# EAGLE design SI4735 Shield-v12 (EAGLE 5.06)
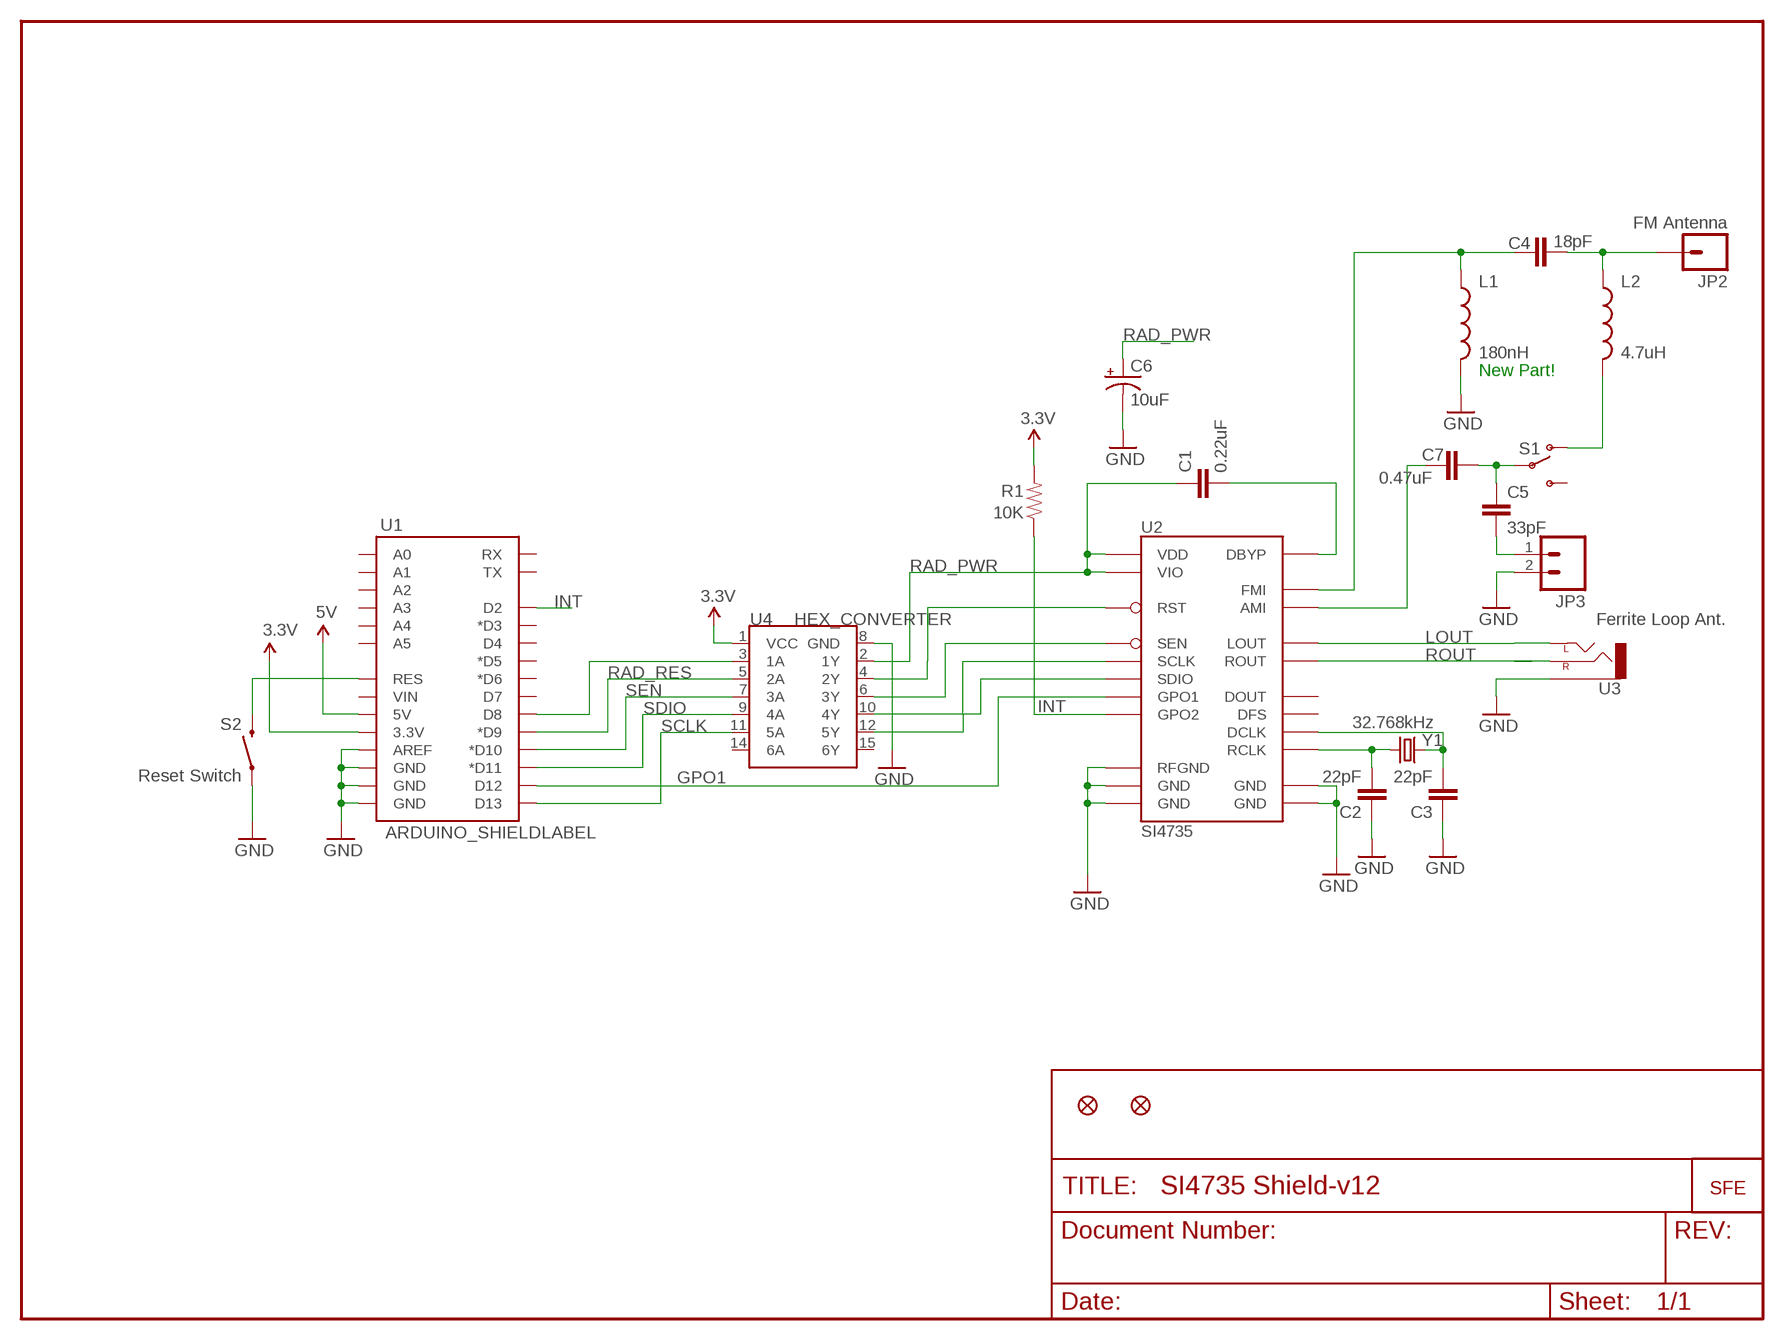
[diagram p0: schematic, sheet 1]

## Parts
C1  0.22uF  CAP0402-CAP  [0402-CAP]
C2  22pF  CAP0402-CAP  [0402-CAP]
C3  22pF  CAP0402-CAP  [0402-CAP]
C4  18pF  CAP0402-CAP  [0402-CAP]
C5  33pF  CAP0402-CAP  [0402-CAP]
C6  10uF  CAP_POL3528  [EIA3528]
C7  0.47uF  CAP0402-CAP  [0402-CAP]
JP1  LOGO-SFENEW  [SFE-NEW-WEBLOGO]
JP2  FM Antenna  M01PTH  [1X01]
JP3  Ferrite Loop Ant.  M02PTH  [1X02]
JP4  FIDUCIAL1X2  [FIDUCIAL-1X2]
JP5  FIDUCIAL1X2  [FIDUCIAL-1X2]
L1  180nH  INDUCTOR0402  [C0402]
L2  4.7uH  INDUCTOR0402  [C0402]
R1  10K  RESISTOR0402-RES  [0402-RES]
S1  SWITCH-SPSTSMD  [AYZ0202]
S2  Reset Switch  SWITCH-MOMENTARY-2SMD  [TACTILE_SWITCH_SMD]
U1  ARDUINO_SHIELDLABEL  [DUEMILANOVE_SHIELD]
U2  SI4735  [SSOP24_NARROW]
U3  AUDIO-JACKSMD2  [AUDIO-JACK-3.5MM-SMD]
U4  HEX_CONVERTER  [SO016]
Y1  32.768kHz  CRYSTAL32-SMD  [CRYSTAL-32KHZ-SMD]

## Nets
3.3V: R1.2 U1.3.3V U4.1(VCC)
5V: U1.5V
GND: C2.1 C3.1 C6.C(-) JP3.2 L1.2 S2.1 U1.AREF U1.GND@0(GND) U1.GND@1(GND) U1.GND@2(GND) U2.9(RFGND) U2.10(GND) U2.11(GND) U2.13(GND) U2.14(GND) U3.SLEEVE U4.8(GND)
GPO1: U1.D12 U2.5(GPO1)
INT: R1.1 U1.D2 U2.4(GPO2)
LOUT: U2.24(LOUT) U3.TIP(LEFT)
N$1: C2.2 U2.19(RCLK) Y1.X1
N$2: C3.2 U2.3(DCLK) Y1.X2
N$3: S2.3 U1.RES
N$4: C1.2 U2.22(DBYP)
N$5: U2.15(RST) U4.4(2Y)
N$12: U2.16(SEN) U4.6(3Y)
N$15: U2.17(SCLK) U4.12(5Y)
N$16: U2.18(SDIO) U4.10(4Y)
N$17: C4.1 L1.1 U2.8(FMI)
N$20: U1.D8 U4.3(1A)
N$21: C4.2 JP2.1 L2.1
N$22: L2.2 S1.1(O)
N$23: C5.1 C7.1 S1.2(P)
N$34: C7.2 U2.12(AMI)
N$35: C5.2 JP3.1
RAD_PWR: C1.1 C6.A(+) U2.20(VIO) U2.21(VDD) U4.2(1Y)
RAD_RES: U1.D9(*D9) U4.5(2A)
ROUT: U2.23(ROUT) U3.RING(RIGHT)
SCLK: U1.D13 U4.11(5A)
SDIO: U1.D11(*D11) U4.9(4A)
SEN: U1.D10(*D10) U4.7(3A)
Unconnected: S1.3(S) U1.A0 U1.A1 U1.A2 U1.A3 U1.A4 U1.A5 U1.D3(*D3) U1.D4 U1.D5(*D5) U1.D6(*D6) U1.D7 U1.RX U1.TX U1.VIN U2.1(DOUT) U2.2(DFS) U4.14(6A) U4.15(6Y)

## Notes on the sheet
- New Part!

## Library data of the parts
C1-C5 C7 = SparkFun:CAP: Capacitor Standard 0603 ceramic capacitor, and 0.1" leaded capacitor.
C6 = SparkFun:CAP_POL: Capacitor Polarized These are standard SMD and PTH capacitors. Normally 10uF, 47uF, and 100uF in electrolytic and tantalum varieties. Always verify the external diameter of the through hole cap, it varies with capacity, voltage, and manufacturer. The EIA devices should be standard.
JP1 = SparkFun:LOGO-SFE: Spark Fun Electronics PCB Logo This is the standard Spark Fun Electronics PCB logo.
JP2 = SparkFun:M01: Header 1 Standard 1-pin 0.1" header. Use with straight break away headers (SKU : PRT-00116), right angle break away headers (PRT-00553), swiss pins (PRT-00743), machine pins (PRT-00117), and female headers (PRT-00115).
JP3 = SparkFun:M02: Header 2 Standard 2-pin 0.1" header. Use with straight break away headers (SKU : PRT-00116), right angle break away headers (PRT-00553), swiss pins (PRT-00743), machine pins (PRT-00117), and female headers (PRT-00115). Molex polarized connector foot print use with SKU : PRT-08233 with associated crimp pins and housings.
JP4 JP5 = SparkFun:FIDUCIAL: Fiducial Alignment Points Various fiducial points for machine vision alignment.
L1 L2 = SparkFun:INDUCTOR: Inductors Basic Inductor/Choke - 0603 and 1206. Footprints are not proven and vary greatly between part numbers.
R1 = SparkFun:RESISTOR: Resistor Basic schematic elements and footprints for 0603, 1206, and PTH resistors.
S1 = SparkFun:SWITCH-SPST: SPST Switch Simple slide switch. Spark Fun Electronics SKU : COM-00102
S2 = SparkFun:SWITCH-MOMENTARY-2
U1 = SparkFun:ARDUINO_SHIELD
U2 = SparkFun:SI4735: Radio chip that covers FM broadcast with RDS, plus a bunch of shortwave and logwave frequencies
U3 = SparkFun:AUDIO-JACK: 3.5mm Audio Jack Simple 3.5mm common PCB mount audio jack. SKU: PRT-08032
U4 = SparkFun:HEX_CONVERTER
Y1 = SparkFun:CRYSTAL: Crystals Various standard crystals. Proven footprints. Spark Fun Electronics SKU : COM-00534

## Board
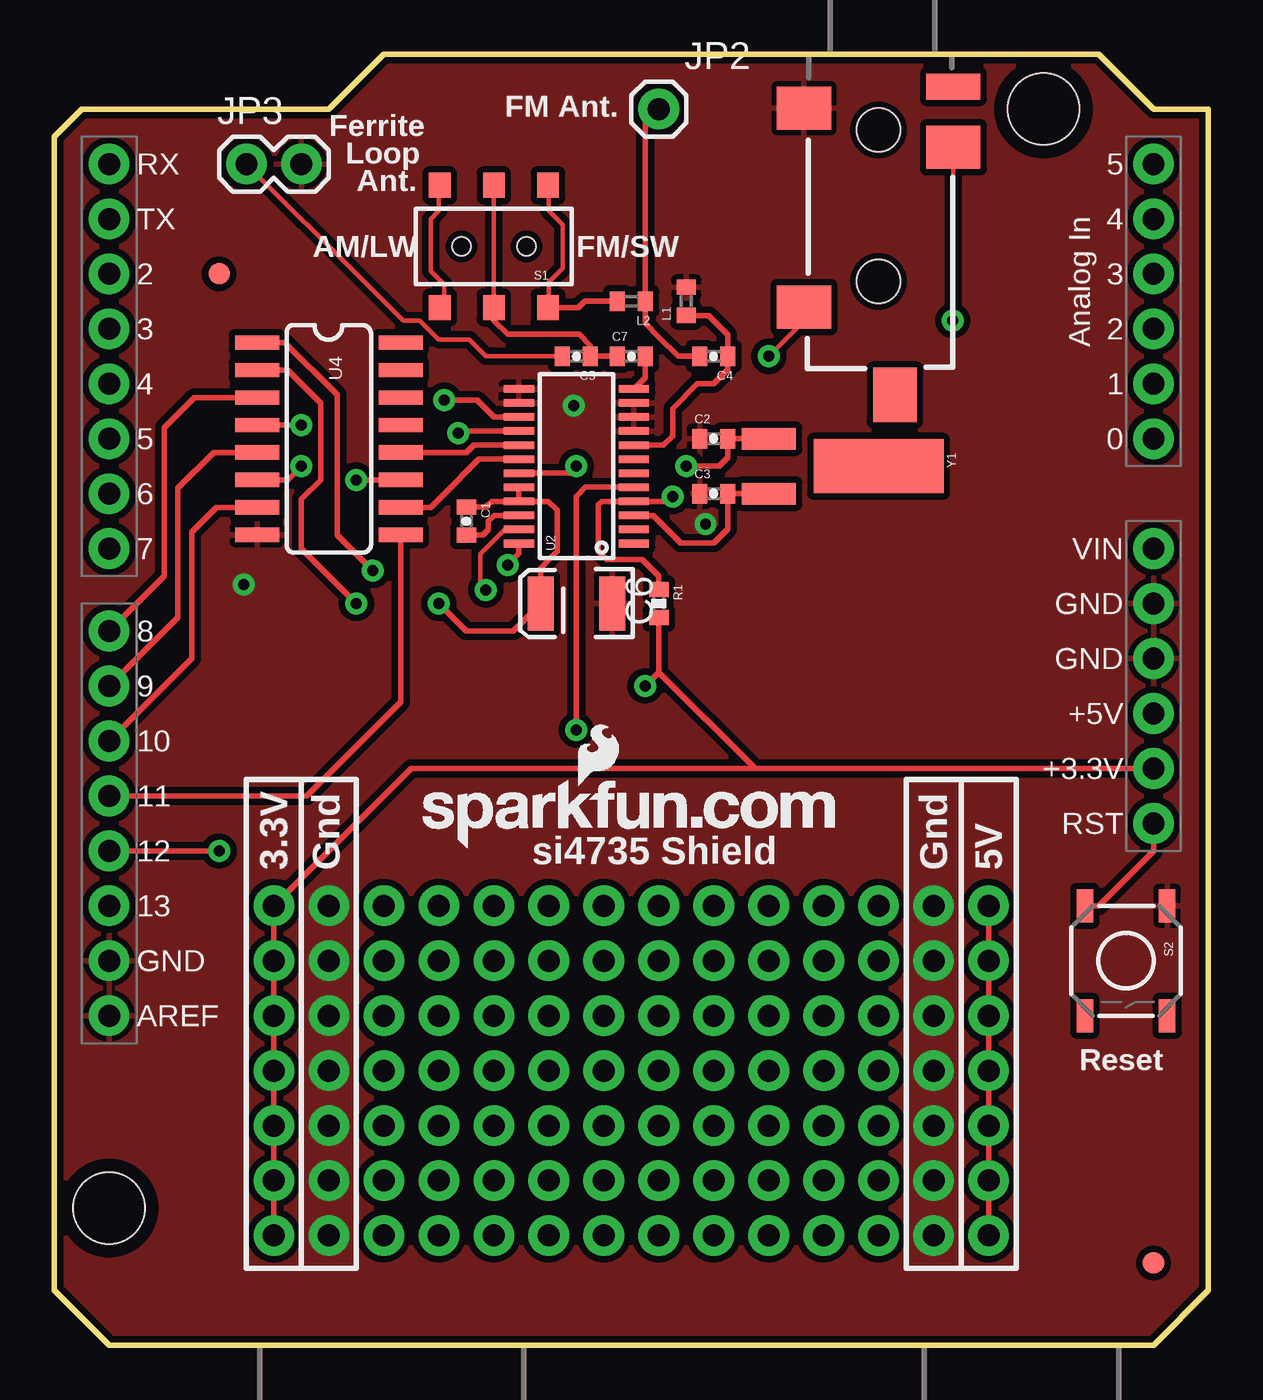
[diagram p1: board, top side]
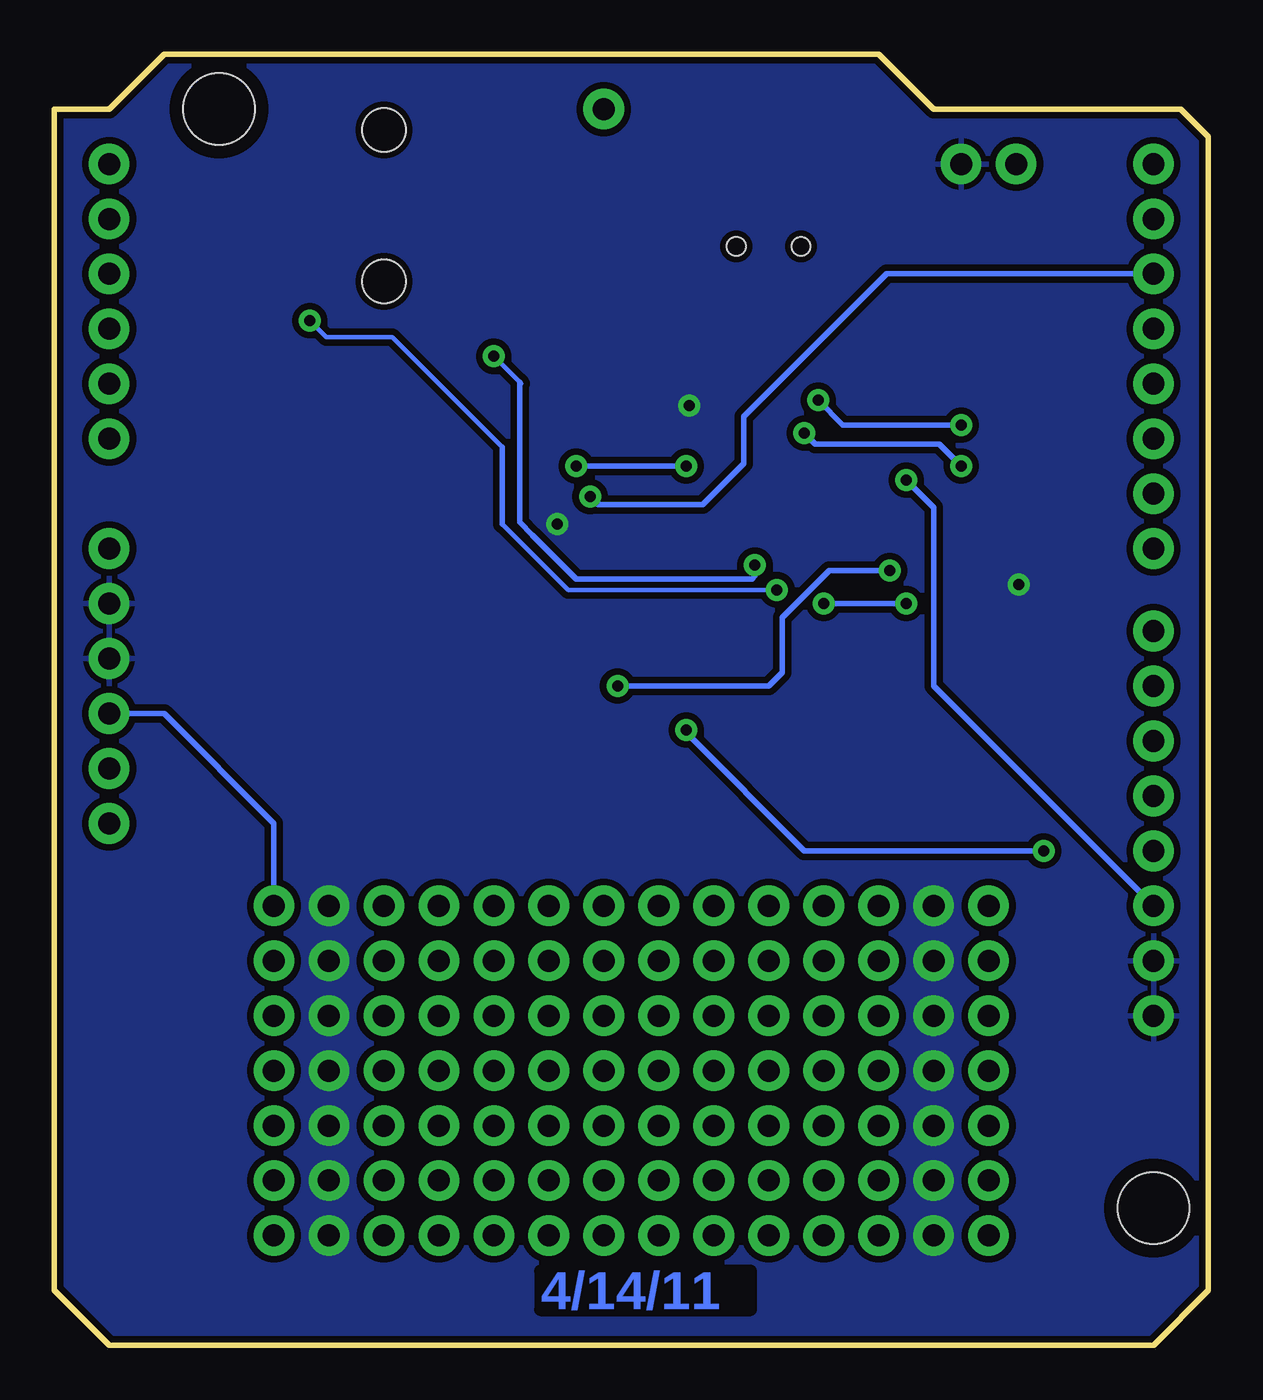
[diagram p2: board, bottom side, seen from below]

Size 53.34 x 59.69 mm. Coordinates in mm from the lower left corner, seen from the top.
Outline: 0,2.54 0,55.88 1.27,57.15 12.7,57.15 15.24,59.69 48.26,59.69 50.8,57.15 53.34,57.15 53.34,2.54 50.8,0 2.54,0 0,2.54
Copper layers (1*16): Top 0.035mm / dielectric 1.5mm / Bottom 0.035mm
Design rules "SparkFun": minimum track width 8mil, minimum drill 20mil, track to track 8mil, track to pad 8mil, pad to pad 8mil, via to via 8mil, smd to smd 8mil, copper to edge 8mil, drill to drill 8mil, minimum pad ring 12mil, minimum via ring 10mil, stop-mask expansion 4mil, vias tented up to drill 20mil, thermal gap 10mil

### Footprints (pad centres in the part's own frame; a part is rotated, then mirrored left to right if it is on the bottom)
0402-CAP = smd 0.7 x 0.9: 1 -0.65,0; 2 0.65,0
EIA3528 = smd 1.2 x 2.5: A 1.65,0; C -1.65,0
1X01 = drill 1.016 pad 1.88 round: 1 0,0
1X02 = drill 1.016 pad 1.88 round: 1 0,0; 2 2.54,0
FIDUCIAL-1X2 = smd 1 x 1: 1 0,0
C0402 = smd 0.7 x 0.9: 1 -0.65,0; 2 0.65,0
0402-RES = smd 0.7 x 0.9: 1 -0.65,0; 2 0.65,0
AYZ0202 = smd 1 x 1.15: 1 -2.5,2.825; 2 0,2.825; 3 2.5,2.825; 4 -2.5,-2.825; 5 0,-2.825; 6 2.5,-2.825 | hole 0.85: 1.5,0; -1.5,0
TACTILE_SWITCH_SMD = smd 1.524 x 0.762: 1 -2.54,1.905; 2 2.54,1.905; 3 -2.54,-1.905; 4 2.54,-1.905
DUEMILANOVE_SHIELD = drill 1.016 pad 1.88 round: 3.3V 50.8,26.67; 5V 50.8,29.21; A0 50.8,41.91; A1 50.8,44.45; A2 50.8,46.99; A3 50.8,49.53; A4 50.8,52.07; A5 50.8,54.61; AREF 2.54,15.24; D2 2.54,49.53; D3 2.54,46.99; D4 2.54,44.45; D5 2.54,41.91; D6 2.54,39.37; D7 2.54,36.83; D8 2.54,33.02; D9 2.54,30.48; D10 2.54,27.94; D11 2.54,25.4; D12 2.54,22.86; D13 2.54,20.32; GND@0 50.8,31.75; GND@1 50.8,34.29; GND@2 2.54,17.78; RES 50.8,24.13; RX 2.54,54.61; TX 2.54,52.07; VIN 50.8,36.83 | hole 3.302: 45.72,57.15; 2.54,6.35
SSOP24_NARROW = smd 0.348 x 1.397: 1 -3.575,-2.65; 2 -2.925,-2.65; 3 -2.275,-2.65; 4 -1.625,-2.65; 5 -0.975,-2.65; 6 -0.325,-2.65; 7 0.325,-2.65; 8 0.975,-2.65; 9 1.625,-2.65; 10 2.275,-2.65; 11 2.925,-2.65; 12 3.575,-2.65; 13 3.575,2.65; 14 2.925,2.65; 15 2.275,2.65; 16 1.625,2.65; 17 0.975,2.65; 18 0.325,2.65; 19 -0.325,2.65; 20 -0.975,2.65; 21 -1.625,2.65; 22 -2.275,2.65; 23 -2.925,2.65; 24 -3.575,2.65
AUDIO-JACK-3.5MM-SMD = smd 2 x 2.5: RING 4.3,3.45; SLEEVE 2.5,-3.45; TIP 11.7,-3.45 | smd 1.2 x 2.5: RSH 1.5,3.45 | smd 2.5 x 2: TSH 15.75,0.75 | hole 2: 3.5,0; 10.5,0
SO016 = smd 0.66 x 2.032: 1 -4.445,-3.315; 2 -3.175,-3.315; 3 -1.905,-3.315; 4 -0.635,-3.315; 5 0.635,-3.315; 6 1.905,-3.315; 7 3.175,-3.315; 8 4.445,-3.315; 9 4.445,3.315; 10 3.175,3.315; 11 1.905,3.315; 12 0.635,3.315; 13 -0.635,3.315; 14 -1.905,3.315; 15 -3.175,3.315; 16 -4.445,3.315
CRYSTAL-32KHZ-SMD = smd 2.5 x 6: SHEILD 0,5.08 | smd 1 x 2.5: X1 -1.27,0; X2 1.27,0

### Placement (x,y rotation side)
C1  19.05,38.1 270 top
C2  30.48,41.91 0 top
C3  30.48,39.37 0 top
C4  30.48,45.72 180 top
C5  24.13,45.72 180 top
C6  24.13,34.29 180 top
C7  26.67,45.72 0 top
JP1  17.02,22.99 0 top
JP2  27.94,57.15 0 top
JP3  8.89,54.61 0 top
JP4  50.8,3.81 0 top
JP5  7.62,49.53 0 top
L1  29.21,48.26 90 top
L2  26.67,48.26 180 top
R1  27.94,34.29 270 top
S1  20.32,50.8 180 top
S2  49.53,17.78 270 top
U1  0,0 0 top
U2  24.13,40.64 90 top
U3  38.1,59.69 270 top
U4  12.7,41.91 270 top
Y1  33.02,40.64 270 top

### Tracks (layer width: path | path; a pad name or v marks a point on that pad's centre or on a via)
3.3V  (via drill 0.51, 1.02 pad 1.88)
  Top 0.254: U4.1 10.67,46.35 13.08,43.94 13.08,39.88 13.08,37.47 v14.73,35.81 | 27.94,31.11 v27.3,30.48 | 27.94,31.11 R1.2 | U1.3.3V 32.38,26.67 32.32,26.73 | 32.32,26.73 27.94,31.11 | v10.16,5.08 v10.16,7.62 v10.16,10.16 v10.16,12.7 v10.16,15.24 v10.16,17.78 v10.16,20.32 16.51,26.67 32.26,26.67 32.32,26.73
  Bottom 0.254: v27.3,30.48 20.32,30.48 19.68,31.11 19.68,33.66 17.53,35.81 v14.73,35.81
5V  (via drill 1.02 pad 1.88)
  Top 0.254: v43.18,20.32 v43.18,17.78 v43.18,15.24 v43.18,12.7 v43.18,10.16 v43.18,7.62 v43.18,5.08
  Bottom 0.254: U1.5V 48.26,29.21 43.18,24.13 v43.18,20.32
GND  (via drill 0.51, 1.02 pad 1.88)
  other vias: 24,43.43 8.76,35.18 30.1,37.97 40.64,20.32 40.64,17.78 40.64,15.24 40.64,12.7 40.64,10.16 40.64,7.62 40.64,5.08 12.7,20.32 12.7,17.78 12.7,15.24 12.7,12.7 12.7,10.16 12.7,7.62 12.7,5.08
  pour Bottom (isolate 0.305): 0,0 0,59.69 53.34,59.69 53.34,0
  pour Top (isolate 0.305): 0,0 0,57.15 2.54,59.69 52.07,59.69 53.34,58.42 53.34,2.54 50.8,0
GPO1  (via drill 0.51)
  Top 0.254: U2.5 25.06,39.66 24.55,39.66 24.13,39.24 v24.13,28.45 | U1.D12 v7.62,22.86
  Bottom 0.254: v24.13,28.45 24.13,28.32 18.67,22.86 v7.62,22.86
INT  (via drill 0.51)
  Top 0.254: R1.1 27.94,35.43 27.94,35.56 27.18,36.32 25.53,36.32 25.15,36.7 25.15,38.86 25.3,39.02 U2.4 28.35,39.02 v28.57,39.24
  Bottom 0.254: U1.D2 14.86,49.53 21.46,42.93 21.46,40.77 23.37,38.86 28.19,38.86 v28.57,39.24
LOUT  (via drill 0.51)
  Top 0.203: U3.TIP 34.65,47.35 v33.02,45.72
  Top 0.254: U2.24 21.48,36.59 v20.95,36.07
  Bottom 0.203: 31.83,44.45 31.75,44.45 v33.02,45.72
  Bottom 0.254: v20.95,36.07 20.95,35.56 21.08,35.43 29.21,35.43 31.24,37.47 31.83,38.05 31.83,44.45 31.83,44.53
N$1  (via drill 0.51)
  Top 0.254: Y1.X1 32.89,41.91 C2.2 31.13,41.04 30.99,40.89 30.73,40.64 v29.21,40.64 | U2.19 23.8,40.31 v24.13,40.64
  Bottom 0.254: v24.13,40.64 v29.21,40.64
N$2
  Top 0.254: Y1.X2 C3.2 31.13,37.73 31.11,37.72 30.73,37.34 30.48,37.08 28.96,37.08 27.68,38.37 U2.3
N$3
  Top 0.254: U1.RES 50.8,22.86 48.26,20.32 48.13,20.32 S2.3
N$4
  Top 0.254: C1.2 19.8,37.45 20.07,37.72 20.07,38.1 20.33,38.37 U2.22
N$5  (via drill 0.51)
  Top 0.254: U4.4 v11.43,42.55 | U2.15 20.33,42.91 19.56,43.69 v18.03,43.69
  Bottom 0.254: v11.43,42.55 16.89,42.55 v18.03,43.69
N$6  (via drill 1.02 pad 1.88)
  other vias: 15.24,5.08
N$7  (via drill 1.02 pad 1.88)
  other vias: 17.78,5.08
N$8  (via drill 1.02 pad 1.88)
  other vias: 20.32,5.08
N$9  (via drill 1.02 pad 1.88)
  other vias: 22.86,5.08
N$10  (via drill 1.02 pad 1.88)
  other vias: 25.4,5.08
N$11  (via drill 1.02 pad 1.88)
  other vias: 27.94,5.08
N$12  (via drill 0.51)
  Top 0.254: U4.6 10.79,40.01 v11.43,40.64 | U2.16 18.77,42.27 v18.67,42.16
  Bottom 0.254: v18.67,42.16 18.16,41.66 14.99,41.66 12.45,41.66 v11.43,40.64
N$13  (via drill 1.02 pad 1.88)
  other vias: 30.48,5.08
N$14  (via drill 1.02 pad 1.88)
  other vias: 33.02,5.08
N$15
  Top 0.254: U4.12 19.05,41.27 19.3,41.53 19.39,41.62 U2.17
N$16
  Top 0.254: U4.10 17.4,38.73 17.91,39.24 19.63,40.97 U2.18
N$17
  Top 0.254: L1.1 30.24,47.61 31.11,46.74 31.13,46.72 C4.1 31.13,45.1 31.11,45.09 30.48,44.45 29.72,44.45 28.57,43.31 28.57,42.04 28.15,41.62 U2.8
N$18  (via drill 1.02 pad 1.88)
  other vias: 35.56,5.08
N$19  (via drill 1.02 pad 1.88)
  other vias: 38.1,5.08
N$20
  Top 0.254: U1.D8 5.08,35.56 5.08,42.42 6.48,43.81 U4.3
N$21
  Top 0.254: C4.2 29.72,45.72 28.83,45.72 27.94,46.61 27.3,47.24 27.3,48.26 L2.1 27.32,56.53 JP2.1
N$22
  Top 0.254: S1.1 24.23,47.98 24.51,48.26 24.64,48.26 L2.2
N$23
  Top 0.203: 20.32,47.88 20.32,53.59
  Top 0.254: C7.1 26.04,45.72 C5.1 24.78,46.21 24.26,46.74 24.13,46.74 20.95,46.74 20.32,47.37 20.32,47.88 S1.2
N$24  (via drill 1.02 pad 1.88)
  other vias: 38.1,7.62
N$25  (via drill 1.02 pad 1.88)
  other vias: 35.56,7.62
N$26  (via drill 1.02 pad 1.88)
  other vias: 33.02,7.62
N$27  (via drill 1.02 pad 1.88)
  other vias: 30.48,7.62
N$28  (via drill 1.02 pad 1.88)
  other vias: 27.94,7.62
N$29  (via drill 1.02 pad 1.88)
  other vias: 25.4,7.62
N$30  (via drill 1.02 pad 1.88)
  other vias: 22.86,7.62
N$31  (via drill 1.02 pad 1.88)
  other vias: 20.32,7.62
N$32  (via drill 1.02 pad 1.88)
  other vias: 17.78,7.62
N$33  (via drill 1.02 pad 1.88)
  other vias: 15.24,7.62
N$34
  Top 0.254: C7.2 27.3,45.72 27.3,44.74 U2.12
N$35
  Top 0.203: C5.2 19.94,45.72 19.18,46.48 19.05,46.48 17.78,46.48 16.89,47.37 16.64,47.37 16.13,47.37 14.35,49.15 JP3.1
N$36
  Top 0.203: 18.03,48.01 18.03,49.02 17.4,49.66 17.4,52.07 17.78,52.45 17.78,53.59
N$37
  Top 0.203: 22.86,48.01 22.86,49.15 23.5,49.78 23.5,51.82 22.86,52.45 22.86,53.72
N$38  (via drill 1.02 pad 1.88)
  other vias: 15.24,10.16
N$39  (via drill 1.02 pad 1.88)
  other vias: 17.78,10.16
N$40  (via drill 1.02 pad 1.88)
  other vias: 20.32,10.16
N$41  (via drill 1.02 pad 1.88)
  other vias: 22.86,10.16
N$42  (via drill 1.02 pad 1.88)
  other vias: 25.4,10.16
N$43  (via drill 1.02 pad 1.88)
  other vias: 27.94,10.16
N$44  (via drill 1.02 pad 1.88)
  other vias: 30.48,10.16
N$45  (via drill 1.02 pad 1.88)
  other vias: 33.02,10.16
N$46  (via drill 1.02 pad 1.88)
  other vias: 35.56,10.16
N$47  (via drill 1.02 pad 1.88)
  other vias: 38.1,10.16
N$52  (via drill 1.02 pad 1.88)
  other vias: 38.1,12.7
N$53  (via drill 1.02 pad 1.88)
  other vias: 35.56,12.7
N$54  (via drill 1.02 pad 1.88)
  other vias: 33.02,12.7
N$55  (via drill 1.02 pad 1.88)
  other vias: 30.48,12.7
N$56  (via drill 1.02 pad 1.88)
  other vias: 27.94,12.7
N$57  (via drill 1.02 pad 1.88)
  other vias: 25.4,12.7
N$58  (via drill 1.02 pad 1.88)
  other vias: 22.86,12.7
N$59  (via drill 1.02 pad 1.88)
  other vias: 20.32,12.7
N$60  (via drill 1.02 pad 1.88)
  other vias: 17.78,12.7
N$61  (via drill 1.02 pad 1.88)
  other vias: 15.24,12.7
N$66  (via drill 1.02 pad 1.88)
  other vias: 15.24,15.24
N$67  (via drill 1.02 pad 1.88)
  other vias: 17.78,15.24
N$68  (via drill 1.02 pad 1.88)
  other vias: 20.32,15.24
N$69  (via drill 1.02 pad 1.88)
  other vias: 22.86,15.24
N$70  (via drill 1.02 pad 1.88)
  other vias: 25.4,15.24
N$71  (via drill 1.02 pad 1.88)
  other vias: 27.94,15.24
N$72  (via drill 1.02 pad 1.88)
  other vias: 30.48,15.24
N$73  (via drill 1.02 pad 1.88)
  other vias: 33.02,15.24
N$74  (via drill 1.02 pad 1.88)
  other vias: 35.56,15.24
N$75  (via drill 1.02 pad 1.88)
  other vias: 38.1,15.24
N$80  (via drill 1.02 pad 1.88)
  other vias: 38.1,17.78
N$81  (via drill 1.02 pad 1.88)
  other vias: 35.56,17.78
N$82  (via drill 1.02 pad 1.88)
  other vias: 33.02,17.78
N$83  (via drill 1.02 pad 1.88)
  other vias: 30.48,17.78
N$84  (via drill 1.02 pad 1.88)
  other vias: 27.94,17.78
N$85  (via drill 1.02 pad 1.88)
  other vias: 25.4,17.78
N$86  (via drill 1.02 pad 1.88)
  other vias: 22.86,17.78
N$87  (via drill 1.02 pad 1.88)
  other vias: 20.32,17.78
N$88  (via drill 1.02 pad 1.88)
  other vias: 17.78,17.78
N$89  (via drill 1.02 pad 1.88)
  other vias: 15.24,17.78
N$94  (via drill 1.02 pad 1.88)
  other vias: 15.24,20.32
N$95  (via drill 1.02 pad 1.88)
  other vias: 20.32,20.32
N$96  (via drill 1.02 pad 1.88)
  other vias: 17.78,20.32
N$97  (via drill 1.02 pad 1.88)
  other vias: 22.86,20.32
N$98  (via drill 1.02 pad 1.88)
  other vias: 27.94,20.32
N$99  (via drill 1.02 pad 1.88)
  other vias: 25.4,20.32
N$100  (via drill 1.02 pad 1.88)
  other vias: 30.48,20.32
N$101  (via drill 1.02 pad 1.88)
  other vias: 33.02,20.32
N$102  (via drill 1.02 pad 1.88)
  other vias: 35.56,20.32
N$103  (via drill 1.02 pad 1.88)
  other vias: 38.1,20.32
RAD_PWR  (via drill 0.51)
  Top 0.254: C1.1 19.95,38.75 20.07,38.86 20.22,39.02 U2.21 | U2.20 21.48,39.64 21.46,39.62 21.48,39.61 U2.21 | U2.21 22.83,39.02 23.24,38.61 23.24,38.35 23.24,36.7 23.11,36.58 22.48,35.94 C6.A 21.21,33.02 20.45,33.02 20.32,33.02 19.05,33.02 v17.78,34.29 | U4.2 10.79,45.09 12.19,43.69 12.32,43.56 12.32,40.39 12.32,40.01 11.43,39.12 11.43,36.83 v13.97,34.29
  Bottom 0.254: v13.97,34.29 v17.78,34.29
RAD_RES
  Top 0.254: U1.D9 5.71,33.66 5.71,35.81 5.71,36.07 5.71,39.62 7.37,41.27 U4.5
ROUT  (via drill 0.51)
  Top 0.203: U2.23 20.82,37.72 20.32,37.21 20.07,36.96 19.68,36.58 19.68,35.81 19.68,35.18 v19.94,34.92 | U3.RING 41.55,47.39 v41.53,47.37
  Bottom 0.203: v19.94,34.92 29.59,34.92 32.51,37.85 32.64,37.97 | 32.64,41.53 36.83,45.72 37.72,46.61 38.23,46.61 40.77,46.61 v41.53,47.37
  Bottom 0.254: 32.64,37.97 32.64,41.53
SCLK  (via drill 0.51)
  Top 0.254: U4.11 15.88,40.01 v13.97,40.01
  Bottom 0.254: U1.D13 12.7,30.48 12.7,37.59 12.7,38.73 v13.97,40.01
SDIO
  Top 0.254: U1.D11 7.62,25.4 7.75,25.4 11.68,25.4 16.02,29.73 U4.9
SEN
  Top 0.254: U1.D10 6.35,31.75 6.35,34.54 6.35,34.67 6.35,37.59 7.49,38.73 U4.7

### Text on the board
Bottom: 4/14/11
tPlace: FM Ant. | Ferrite | Loop | Ant. | AM/LW | FM/SW | si4735 Shield | 3.3V | Gnd | Gnd | 5V | Reset